# EAGLE schematic Printer (EAGLE 9.6.2)
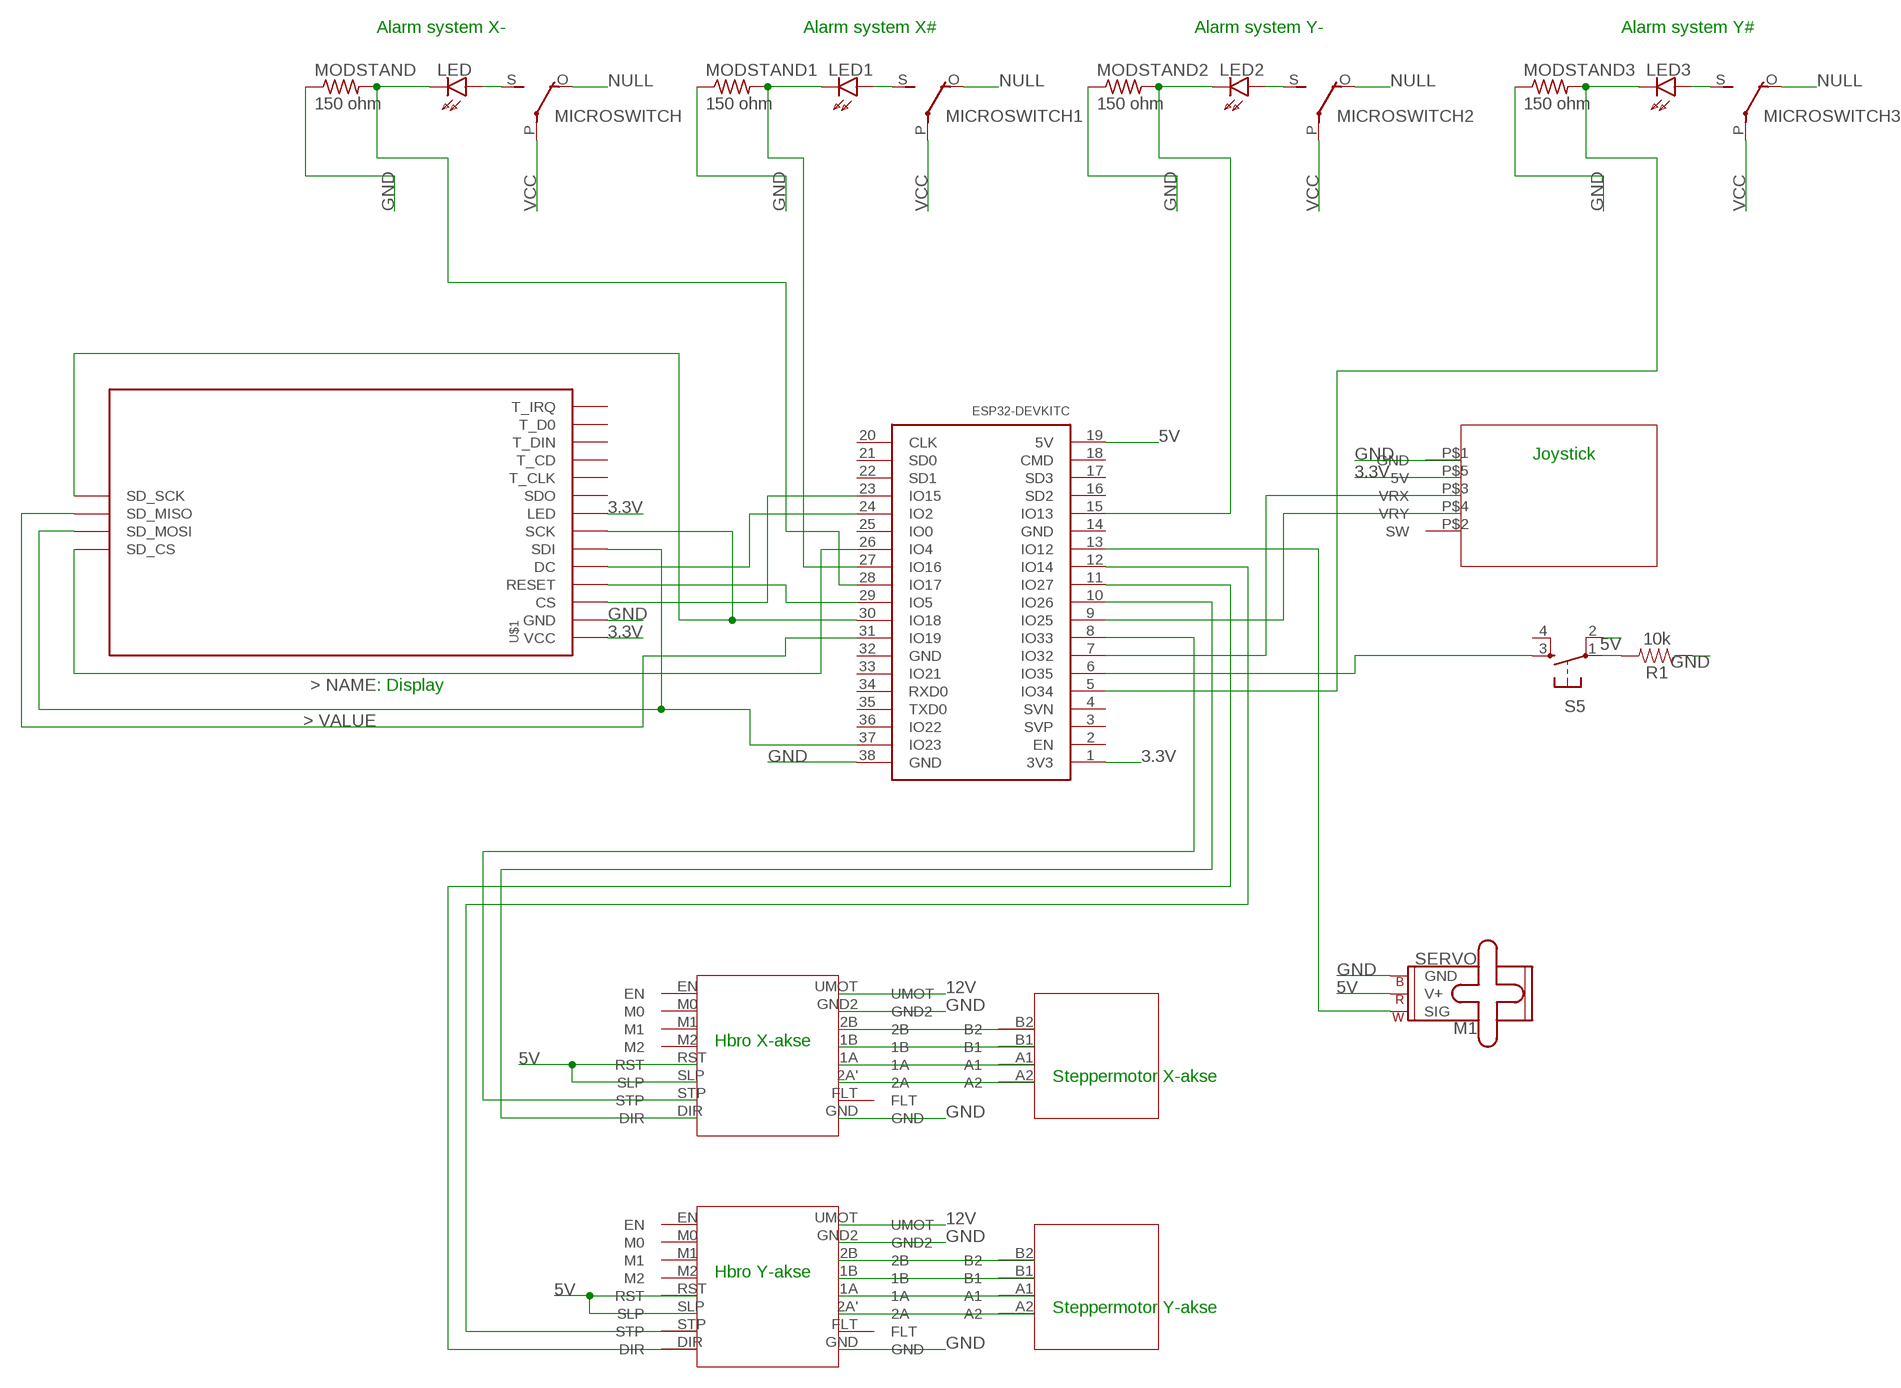
[diagram p0: schematic, sheet 1]

## Parts
LED  HLMP6  [HLMP6]
LED1  HLMP6  [HLMP6]
LED2  HLMP6  [HLMP6]
LED3  HLMP6  [HLMP6]
M1  SERVO  [1X03]
MICROSWITCH  E3206S  [E3206S]
MICROSWITCH1  E3206S  [E3206S]
MICROSWITCH2  E3206S  [E3206S]
MICROSWITCH3  E3206S  [E3206S]
MODSTAND  150 ohm  R-US_0204/7  [0204/7]
MODSTAND1  150 ohm  R-US_0204/7  [0204/7]
MODSTAND2  150 ohm  R-US_0204/7  [0204/7]
MODSTAND3  150 ohm  R-US_0204/7  [0204/7]
R1  10k  10KOHM-HORIZ-1/4W-1%  [AXIAL-0.3]
S5  TAC_SWITCHPTH  [TACTILE-PTH]
TFT_DISPLAY  TFT  (no package)
U$1  ESP32DEVKITC  [ESP32-DEVKITC]
U$2  STEPPERMOTOR  [STEPPERMOTOR]
U$3  STEPPERMOTOR  [STEPPERMOTOR]
U$4  JOYSTICK  [JOYSTICK]
U$5  HBRO  [BHRO]
U$6  HBRO  [BHRO]

## Nets
3.3V: TFT_DISPLAY.LED TFT_DISPLAY.VCC U$1.1(3V3) U$4.P$5(5V)
5V: M1.2(V+) S5.2 U$1.19(5V) U$5.RST U$5.SLP U$6.RST U$6.SLP
12V: U$5.UMOT U$6.UMOT
DATA: LED1.K LED2.K LED3.K LED.K MODSTAND1.2 MODSTAND2.2 MODSTAND3.2 MODSTAND.2 U$1.5(IO34) U$1.15(IO13) U$1.27(IO16) U$1.28(IO17)
GND: M1.3(GND) MODSTAND1.1 MODSTAND2.1 MODSTAND3.1 MODSTAND.1 R1.P$1 TFT_DISPLAY.GND U$1.38(GND) U$4.P$1(GND) U$5.GND U$5.GND2 U$6.GND U$6.GND2
N$1: TFT_DISPLAY.CS U$1.23(IO15)
N$2: TFT_DISPLAY.RESET U$1.29(IO5)
N$3: TFT_DISPLAY.DC U$1.24(IO2)
N$4: TFT_DISPLAY.SCK TFT_DISPLAY.SD_SCK U$1.30(IO18)
N$5: LED.A MICROSWITCH.S(2:S)
N$6: LED1.A MICROSWITCH1.S(2:S)
N$7: TFT_DISPLAY.SD_MOSI TFT_DISPLAY.SDI U$1.37(IO23)
N$8: LED2.A MICROSWITCH2.S(2:S)
N$9: TFT_DISPLAY.SD_CS U$1.26(IO4)
N$10: LED3.A MICROSWITCH3.S(2:S)
N$11: U$1.7(IO32) U$4.P$3(VRX)
N$12: U$1.9(IO25) U$4.P$4(VRY)
N$13: S5.3 U$1.6(IO35)
N$14: U$1.8(IO33) U$5.STP
N$15: U$1.10(IO26) U$5.DIR
N$16: U$1.11(IO27) U$6.DIR
N$17: U$1.12(IO14) U$6.STP
N$18: M1.1(SIG) U$1.13(IO12)
N$19: U$2.B2 U$5.2B
N$20: U$2.B1 U$5.1B
N$21: U$2.A1 U$5.1A
N$22: U$2.A2 U$5.2A'(2A)
N$23: U$3.B2 U$6.2B
N$24: U$3.B1 U$6.1B
N$25: U$3.A1 U$6.1A
N$26: U$3.A2 U$6.2A'(2A)
N$27: R1.P$2 S5.1
NULL: MICROSWITCH1.O(2:O) MICROSWITCH2.O(2:O) MICROSWITCH3.O(2:O) MICROSWITCH.O(2:O)
TFT: TFT_DISPLAY.SD_MISO U$1.31(IO19)
VCC: MICROSWITCH1.P(2:P) MICROSWITCH2.P(2:P) MICROSWITCH3.P(2:P) MICROSWITCH.P(2:P)
Unconnected: MICROSWITCH1.1 MICROSWITCH1.2 MICROSWITCH2.1 MICROSWITCH2.2 MICROSWITCH3.1 MICROSWITCH3.2 MICROSWITCH.1 MICROSWITCH.2 S5.4 TFT_DISPLAY.SDO TFT_DISPLAY.T_CD TFT_DISPLAY.T_CLK TFT_DISPLAY.T_D0 TFT_DISPLAY.T_DIN TFT_DISPLAY.T_IRQ U$1.2(EN) U$1.3(SVP) U$1.4(SVN) U$1.14(GND) U$1.16(SD2) U$1.17(SD3) U$1.18(CMD) U$1.20(CLK) U$1.21(SD0) U$1.22(SD1) U$1.25(IO0) U$1.32(GND) U$1.33(IO21) U$1.34(RXD0) U$1.35(TXD0) U$1.36(IO22) U$4.P$2(SW) U$5.EN U$5.FLT U$5.M0 U$5.M1 U$5.M2 U$6.EN U$6.FLT U$6.M0 U$6.M1 U$6.M2

## Notes on the sheet
- Alarm system X- | Alarm system X# | Alarm system Y- | Alarm system Y#
- Joystick
- : Display
- Hbro X-akse
- Steppermotor X-akse
- Hbro Y-akse
- Steppermotor Y-akse

## Library data of the parts
LED LED1-LED3 = display-hp:HLMP6: LED 2mm horizontal; MF: AGILENT TECHNOLOGIES; MPN: HLMP-6500; OC_FARNELL: 1652490; OC_NEWARK: 40K0088
M1 = SparkFun-Electromechanical:SERVO: Servo Motor 3-pin connector for a standard servo motor (voltage supply, ground, and control signal.) SparkFun Products Servo - Generic (Sub-Micro Size) <https://www.sparkfun.com/products/9065> (ROB-09065) Servo - Generic High Torque Continuous Rotation (Standard Size) <https://www.sparkfun.com/products/9347> (ROB-09347) Servo - Generic High Torque (Standard Size) <https://www.sparkfun.com/products/11965> (ROB-11965)
MICROSWITCH MICROSWITCH1-MICROSWITCH3 = relay:E3206S: RELAY 1 x switch, Eichhoff/distributor Schukat; OC_FARNELL: unknown; OC_NEWARK: unknown
MODSTAND MODSTAND1-MODSTAND3 = rcl:R-US_: RESISTOR, American symbol; SPICEPREFIX: R
R1 = SparkFun-Resistors:10KOHM: 10kΩ resistor A resistor is a passive two-terminal electrical component that implements electrical resistance as a circuit element. Resistors act to reduce current flow, and, at the same time, act to lower voltage levels within circuits. - Wikipedia; PROD_ID: RES-12183
S5 = SparkFun-Retired:TAC_SWITCH: Momentary Switch Button commonly used for reset or general input. Spark Fun Electronics SKU : COM-00097 SMT- SWCH-08247; SPICEPREFIX: S
TFT_DISPLAY = tftdisplay:TFT
U$1 = ESP32-DEVKITC:ESP32DEVKITC
U$2 U$3 = tftdisplay:STEPPERMOTOR
U$4 = tftdisplay:JOYSTICK
U$5 U$6 = tftdisplay:HBRO

## Module TFT
Ports: 

### Library data of the parts